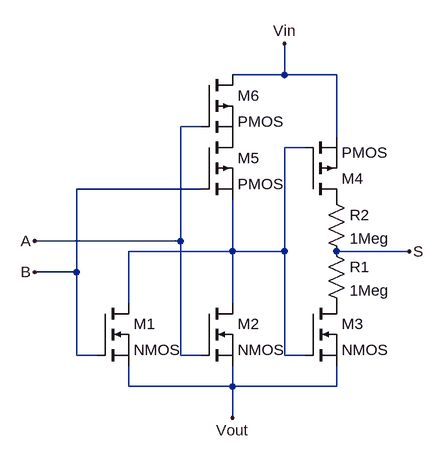
[diagram p0: schematic OR.asc]
OR.asc, the LTspice schematic file:
Version 4
SHEET 1 880 680
WIRE 400 -192 400 -240
WIRE 400 -192 320 -192
WIRE 480 -192 400 -192
WIRE 272 -112 240 -112
WIRE 480 -96 480 -192
WIRE 432 -80 400 -80
WIRE 272 -16 80 -16
WIRE 240 64 240 -112
WIRE 240 64 16 64
WIRE 320 80 320 0
WIRE 320 80 160 80
WIRE 400 80 400 -80
WIRE 400 80 320 80
WIRE 592 80 480 80
WIRE 80 112 80 -16
WIRE 80 112 16 112
WIRE 160 160 160 80
WIRE 320 160 320 80
WIRE 80 240 80 112
WIRE 112 240 80 240
WIRE 240 240 240 64
WIRE 272 240 240 240
WIRE 400 240 400 80
WIRE 432 240 400 240
WIRE 160 288 160 256
WIRE 320 288 320 256
WIRE 320 288 160 288
WIRE 480 288 480 256
WIRE 480 288 320 288
WIRE 320 336 320 288
FLAG 16 64 A
FLAG 16 112 B
FLAG 592 80 S
FLAG 400 -240 Vin
FLAG 320 336 Vout
SYMBOL nmos 112 160 R0
SYMATTR InstName M1
SYMBOL nmos 272 160 R0
SYMATTR InstName M2
SYMBOL nmos 432 160 R0
SYMATTR InstName M3
SYMBOL pmos 432 0 M180
SYMATTR InstName M4
SYMBOL res 464 64 R0
SYMATTR InstName R1
SYMATTR Value 1Meg
SYMATTR SpiceLine tol=1 pwr=0.1
SYMBOL res 464 -16 R0
SYMATTR InstName R2
SYMATTR Value 1Meg
SYMATTR SpiceLine tol=1 pwr=0.1
SYMBOL pmos 272 -96 R0
SYMATTR InstName M5
SYMBOL pmos 272 -192 R0
SYMATTR InstName M6

The netlist it stands for:
* OR.asc
M1 N001 B Vout Vout NMOS
M2 N001 A Vout Vout NMOS
M3 P001 N001 Vout Vout NMOS
M4 P002 N001 Vin Vin PMOS
R1 S P001 1Meg tol=1 pwr=0.1
R2 P002 S 1Meg tol=1 pwr=0.1
M5 P003 B N001 N001 PMOS
M6 Vin A P003 P003 PMOS
.model NMOS NMOS
.model PMOS PMOS
.lib standard.mos
.backanno
.end